# Altium schematic sheet bms_FET_R00.SchDoc: **
size A4; Author: **; CompanyName: Introducción al Diseño de Circuitos Impresos; Organization: UTN FRBA; Revision: **
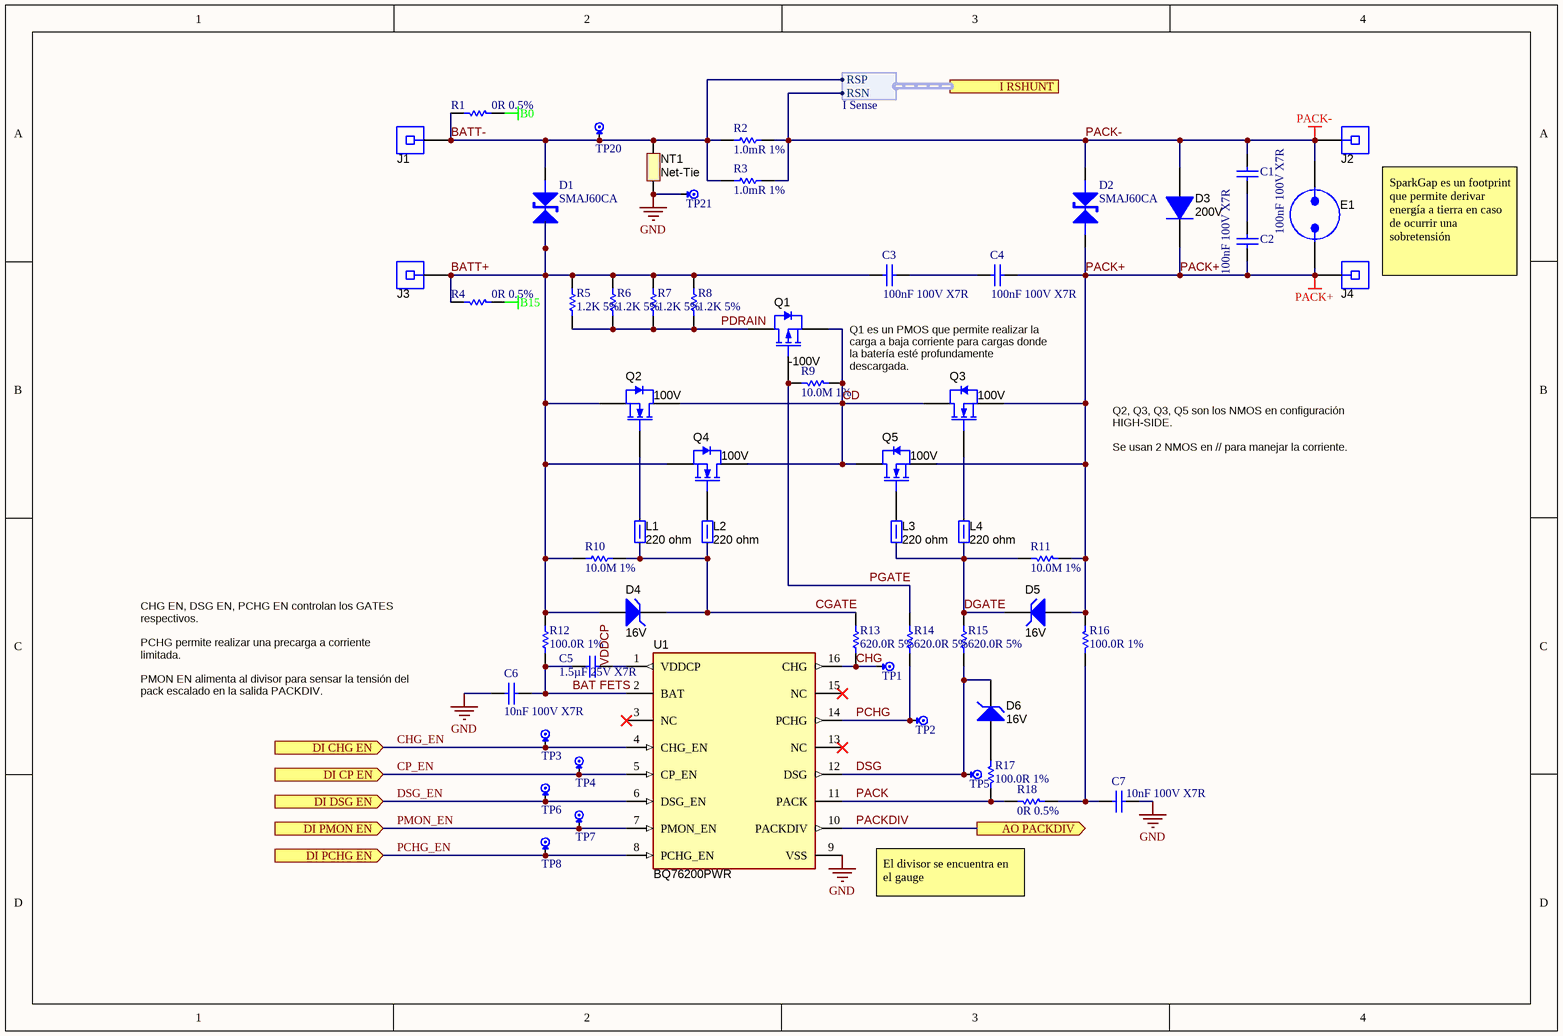
[diagram p0: bms_FET_R00.SchDoc]

## Parts
C1  100nF 100V X7R  [C0603]
C2  100nF 100V X7R  [C0603]
C3  100nF 100V X7R  [C0603]
C4  100nF 100V X7R  [C0603]
C5  1.5µF 25V X7R  [0805_HV_2]
C6  10nF 100V X7R  [0805_HV_2]
C7  10nF 100V X7R  [0805_HV_2]
D1  SMAJ60CA  [DO-214AB(SMA)]
D2  SMAJ60CA  [DO-214AB(SMA)]
D3  value 200V  [SMC]  (hidden comment: ES3D-E3/57T)
D4  value 16V  [sod-323]  (hidden comment: MMSZ5246BS-7-F)
D5  value 16V  [sod-323]  (hidden comment: MMSZ5246BS-7-F)
D6  value 16V  [sod-323]  (hidden comment: MMSZ5246BS-7-F)
E1  N/A  [SPARK_GAP2]  (value not drawn)
J1  L35  [TB_L35]  (value not drawn)
J2  L35  [TB_L35]  (value not drawn)
J3  L35  [TB_L35]  (value not drawn)
J4  L35  [TB_L35]  (value not drawn)
L1  value 220 ohm  [0603 FB]  (hidden comment: BLM18SG221TN1D)
L2  value 220 ohm  [0603 FB]  (hidden comment: BLM18SG221TN1D)
L3  value 220 ohm  [0603 FB]  (hidden comment: BLM18SG221TN1D)
L4  value 220 ohm  [0603 FB]  (hidden comment: BLM18SG221TN1D)
NT1  Net-Tie  [Net-Tie_50milWide_30milLong]  (net tie, no BOM)
Q1  value -100V  [SOT-23]  (hidden comment: ZXMP10A13FTA)
Q2  value 100V  [KTT0002A_N]  (hidden comment: CSD19536KTT)
Q3  value 100V  [KTT0002A_N]  (hidden comment: CSD19536KTT)
Q4  value 100V  [KTT0002A_N]  (hidden comment: CSD19536KTT)
Q5  value 100V  [KTT0002A_N]  (hidden comment: CSD19536KTT)
R1  0R 0.5%  [R0603]
R2  1.0mR 1%  [2010]
R3  1.0mR 1%  [2010]
R4  0R 0.5%  [R0603]
R5  1.2K 5%  [2512]
R6  1.2K 5%  [2512]
R7  1.2K 5%  [2512]
R8  1.2K 5%  [2512]
R9  10.0M 1%  [R0603]
R10  10.0M 1%  [R0603]
R11  10.0M 1%  [R0603]
R12  100.0R 1%  [R0603]
R13  620.0R 5%  [R0603]
R14  620.0R 5%  [R0603]
R15  620.0R 5%  [R0603]
R16  100.0R 1%  [R0603]
R17  100.0R 1%  [R0603]
R18  0R 0.5%  [R0603]
TP1  Test Point  [TEST POINT SMD 1]  (value not drawn)
TP2  Test Point  [TEST POINT SMD 1]  (value not drawn)
TP3  Test Point  [TEST POINT SMD 1]  (value not drawn)
TP4  Test Point  [TEST POINT SMD 1]  (value not drawn)
TP5  Test Point  [TEST POINT SMD 1]  (value not drawn)
TP6  Test Point  [TEST POINT SMD 1]  (value not drawn)
TP7  Test Point  [TEST POINT SMD 1]  (value not drawn)
TP8  Test Point  [TEST POINT SMD 1]  (value not drawn)
TP20  Test Point  [TEST POINT SMD 1]  (value not drawn)
TP21  Test Point  [TEST POINT SMD 1]  (value not drawn)
U1  BQ76200PWR  [PW0016A_N]

## Ports
AO PACKDIV (out), DI CHG EN (in), DI CP EN (in), DI DSG EN (in), DI PCHG EN (in), DI PMON EN (in), I RSHUNT (harness I Sense)

## Harnesses
I Sense: RSP, RSN

## Nets
B0: R1.2
B15: R4.2
GND: C6.1 C7.2 NT1.1 TP21.1 U1.9(VSS)
PACK+: C2.1 C4.2 D2.K D3.1(K) D5.2(A) E1.1 J4.1 Q3.3(S) Q5.3(S) R11.2 R16.2
PACK-: C1.2 D2.A D3.2(A) E1.2 J2.1 R2.2 R3.2 ; port I RSHUNT.RSN
BAT FETS: C5.1 C6.2 R12.1 U1.2(BAT)
BATT+: C3.1 D1.K D4.2(A) J3.1 Q2.3(S) Q4.3(S) R4.1 R5.2 R6.2 R7.2 R8.2 R10.2 R12.2
BATT-: D1.A J1.1 NT1.2 R1.1 R2.1 R3.1 TP20.1 ; port I RSHUNT.RSP
CD: Q1.2(S) Q2.2(D) Q3.2(D) Q4.2(D) Q5.2(D) R9.2
CGATE: D4.1(K) L1.1 L2.1 R10.1 R13.1
CHG: R13.2 TP1.1 U1.16(CHG)
CHG_EN: TP3.1 U1.4(CHG_EN) ; port DI CHG EN
CP_EN: TP4.1 U1.5(CP_EN) ; port DI CP EN
DGATE: D5.1(K) L3.1 L4.1 R11.1 R15.1
DSG: D6.1(K) R15.2 TP5.1 U1.12(DSG)
DSG_EN: TP6.1 U1.6(DSG_EN) ; port DI DSG EN
PACK: R17.1 R18.2 U1.11(PACK)
PACKDIV: U1.10(PACKDIV) ; port AO PACKDIV
PCHG: R14.2 TP2.1 U1.14(PCHG)
PCHG_EN: TP8.1 U1.8(PCHG_EN) ; port DI PCHG EN
PDRAIN: Q1.3(D) R5.1 R6.1 R7.1 R8.1
PGATE: Q1.1(G) R9.1 R14.1
PMON_EN: TP7.1 U1.7(PMON_EN) ; port DI PMON EN
VDDCP: C5.2 U1.1(VDDCP)
NetC1_1: C1.1 C2.2
NetC3_2: C3.2 C4.1
NetC7_1: C7.1 R16.1 R18.1
NetD6_2: D6.2(A) R17.2
NetL1_2: L1.2 Q2.1(G)
NetL2_2: L2.2 Q4.1(G)
NetL3_2: L3.2 Q5.1(G)
NetL4_2: L4.2 Q3.1(G)

Not connected (* = marked no-connect by the designer): U1 3(NC)* 13(NC)* 15(NC)*

## Notes on the sheet
- SparkGap es un footprint que permite derivar energía a tierra en caso de ocurrir una sobretensión
- Q1 es un PMOS que permite realizar la carga a baja corriente para cargas donde la batería esté profundamente descargada.
- Q2, Q3, Q3, Q5 son los NMOS en configuración HIGH-SIDE.
  Se usan 2 NMOS en // para manejar la corriente.
- CHG EN, DSG EN, PCHG EN controlan los GATES respectivos.
  PCHG permite realizar una precarga a corriente limitada.
  PMON EN alimenta al divisor para sensar la tensión del pack escalado en la salida PACKDIV.
- El divisor se encuentra en el gauge

## Library data of the parts
C1-C4 = Cap 0603: Capacitor
C5-C7 = Cap 0805_HV: Capacitor
D1 D2 = SMAJ60CA: TVS DIODE 22VWM 35.5VC DO214AC. / BIDIRECCIONAL
D3 = ES3D-E3/57T: Diode, Ultrafast, 200V, 3A, SMC; Manufacturer: Vishay-Semiconductor; U/M: EA; Vf_V: 0.9; Value2: 0.9V; Io_A: 3; Vr_V: 200; TJmax_C: 150; SymbolVersion: 2008-12-08; PartNumber: ES3D-E3/57T; PackageReference: SMC; CompType: Diode; Value1: 3A; MountType: SMT; Type: Ultrafast; RoHS: Y; Published: 2008-06-26; Publisher: Texas Instruments; LatestRevisionDate: 2014-01-31; ComponentLink1Description: Datasheet link; ComponentLink1URL: http://www.vishay.com/docs/88589/88589.pdf; Supplier 1: Digi-Key; Supplier Part Number 1: ES3D-E3/57TGICT-ND; Supplier 2: Mouser; Supplier Part Number 2: 625-ES3D-E3; Supplier 3: Farnell; Supplier Part Number 3: 1021753
D4-D6 = MMSZ5246BS-7-F: Diode, Zener, 16 V, 200 mW, SOD-323; Manufacturer: Diodes Inc.; SymbolCreator: a0412235; U/M: EA; Power_W: 0.2; Vz_V: 16; Value1: 0.2W; RJA_CperW: 350; AEC Category: Q101; SymbolVersion: 2010-08-25; PartNumber: MMSZ5246BS-7-F; PackageReference: SOD-323; CompType: Zener; Vr_V: N/A; MountType: SMT; RoHS: Y; ComponentLink1Description: Datasheet link; ComponentLink1URL: http://www.diodes.com/datasheets/ds31038.pdf; Published: 2008-10-08; Publisher: Texas Instruments; LatestRevisionDate: 2016-02-26; LatestRevisionNote: Updated Supplier Data; Supplier 1: Digi-Key; Supplier Part Number 1: MMSZ5246BS-FDICT-ND; Supplier 2: Mouser; Supplier Part Number 2: 621-MMSZ5246BS-7-F; AEC Qualified: ?
E1 = SparkGap: Spark Gap; SymbolCreator: a0412235; SymbolVersion: 2013-07-11; Manufacturer: N/A; PartNumber: N/A; MountType: N/A; CompType: Spark Gap; Publisher: Texas Instruments; LatestRevisionDate: 2013-12-05; LatestRevisionNote: Added Alternate PartNumber and Alternate Manufacturer parameters to appropriate components.; Alternate Manufacturer: -; Alternate PartNumber: -
J1-J4 = L35: Connector, L Type Copper Single Conductor, TH; Manufacturer: Thomas & Betts; SymbolCreator: a0799628; Gender: Female; Row_Count: 1; SymbolVersion: 2014-1-06; PartNumber: L35; PackageReference: Connector, L Type Copper Single Conductor, TH; CompType: Connector; RoHS: N; MountType: TH; ComponentLink1Description: Datasheet URL; ComponentLink1URL: http://www.tnb.com/ps/fulltilt/index.cgi?check=Y&part=L35; Orientation: Vertical; PinCount: 1; ContactFinish: Copper; Publisher: Texas Instruments; LatestRevisionDate: 2016-07-21
L1-L4 = BLM18SG221TN1D: Ferrite Bead, 220 ohm @ 100 MHz, 2.5 A, 0603; Manufacturer: MuRata; Imax_A: 2.5; DCR_ohm: 0.04; Value1: 0.04 ohm; Value2: 2.5A; ZTyp@100MHz_Ohm: 220; CompType: Ferrite Bead; SymbolVersion: 2009-06-02; PartNumber: BLM18SG221TN1D; MountType: SMT; PackageReference: 0603; Published: 2014-04-30; Publisher: Texas Instruments; LatestRevisionDate: 2015-05-26; ComponentLink1Description: Datasheet link; ComponentLink1URL: http://search.murata.co.jp/Ceramy/image/img/PDF/ENG/L0110S0100BLM18S.pdf; RoHS: Y; Supplier 1: Digi-Key; Supplier Part Number 1: 490-5225-1-ND; Supplier 2: Mouser; Supplier Part Number 2: 81-BLM18SG221TN1D; Supplier 3: Farnell; Supplier Part Number 3: 1515753
NT1 = Net-Tie: Single point connection between nets.; SymbolCreator: codlsc; SymbolVersion: 2009-07-01; MountType: SMT; PackageReference: N/A; Publisher: Texas Instruments; LatestRevisionDate: 2015-10-18; LatestRevisionNote: Added Alternate PartNumber and Alternate Manufacturer parameters to appropriate components.
Q1 = ZXMP10A13FTA: MOSFET, P-CH, -100V, -0.6A, SOT-23; Manufacturer: Diodes Inc.; Alternate Manufacturer: None; U/M: EA; ChType: P; VdsMax_V: -100; Value1: 1 ohm; Rdson45_Ohm: 1; Value2: 3.5 nC; QgTyp_nC: 3.5; Vgs_V: -4; IdsMax_A: -0.6; SymbolVersion: 2008-07-09; PartNumber: ZXMP10A13FTA; PackageReference: SOT-23; CompType: MOSFET; RoHS: Y; MountType: SMT; Published: 2008-06-19; Publisher: Texas Instruments; LatestRevisionDate: 2013-12-01; LatestRevisionNote: Added parts.; ComponentLink1Description: Datasheet link; ComponentLink1URL: http://www.diodes.com/datasheets/ZXMP10A13F.pdf; Supplier 1: Digi-Key; Supplier Part Number 1: ZXMP10A13FCT-ND; Supplier 2: Mouser; Supplier Part Number 2: 522-ZXMP10A13FTA; Supplier 3: Farnell; Supplier Part Number 3: 1843777
Q2-Q5 = CSD19536KTT: MOSFET, N-CH, 100 V, 200 A, KTT0002A; Manufacturer: Texas Instruments; Alternate Manufacturer: None; U/M: EA; ChType: N; VdsMax_V: 100; Value1: ? ohm; Value2: 118 nC; QgTyp_nC: 118; Vgs_V: 20; IdsMax_A: 200; AEC Category: Q101; SymbolVersion: 2008-07-28; PartNumber: CSD19536KTT; PackageReference: KTT0002A; CompType: MOSFET; RoHS: Y; MountType: SMT; Published: 2008-06-19; Publisher: Texas Instruments; LatestRevisionDate: 2016-02-08; LatestRevisionNote: Added parts.; ComponentLink1Description: Datasheet link; ComponentLink1URL: http://www.ti.com/lit/ds/symlink/csd19536ktt.pdf; Supplier 1: Digi-Key; Supplier Part Number 1: 296-41136-1-ND; Supplier 2: Mouser; Supplier Part Number 2: 595-CSD19536KTT; AEC Qualified: ?
R1-R18 = Res: Resistor
U1 = BQ76200PWR: bq76200: Low-Power, High-Side N-channel FET Driver with Pack Voltage Monitor, PW0016A; Manufacturer: Texas Instruments; SymbolCreator: x0208325; SizeArea_mm2: 32; SizeAreaWB_mm2: 58.8; SizeX_mm: 6.4; SizeY_mm: 5; SizeZ_mm: 1.2; CompType: IC; U/M: EA; SymbolVersion: 2013-12-26; PartNumber: BQ76200PWR; Alternate PartNumber: BQ76200PW; PackageReference: PW0016A; PackageDescription: TSSOP-16; MountType: SMT; ComponentLink1Description: Datasheet Link; ComponentLink1URL: http://www.ti.com/lit/ds/symlink/bq76200.pdf; RoHS: Y; Publisher: Texas Instruments; LatestRevisionDate: 2016-06-17; Alternate Manufacturer: Texas Instruments